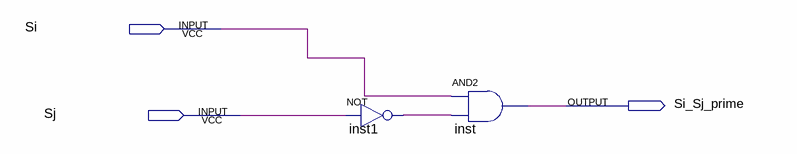
[diagram p0: schematic sheet]
// Quartus schematic Si_Sj_prime.bdf as structural Verilog: 2 symbols, 3 pins
module Si_Sj_prime (
  input  Si,
  input  Sj,
  output Si_Sj_prime
);

  wire inst1_out;

  not inst1 (inst1_out, Sj);
  and inst (Si_Sj_prime, Si, inst1_out);
endmodule
